# EAGLE design inductor_test_2v0 (EAGLE 6.3)

## Sheet 1 of 5: Inductors
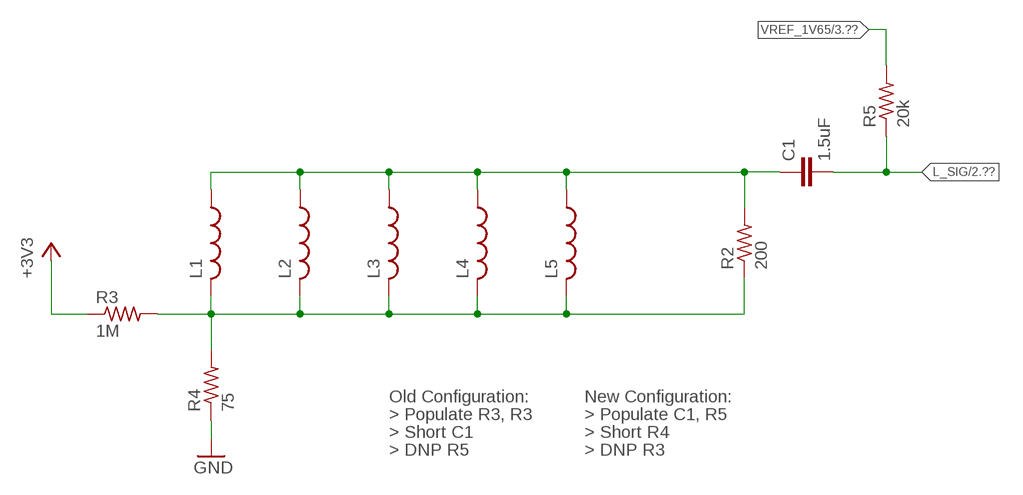
[diagram p0: schematic, sheet 1]

### Parts
C1  1.5uF  C-EUC0402  [C0402]
L1  L-USL0805  [L0805]
L2  L-USL0805  [L0805]
L3  L-USL0805  [L0805]
L4  L-USL0805  [L0805]
L5  L-USL0805  [L0805]
R2  200  R-US_R0402  [R0402]
R3  1M  R-US_R0402  [R0402]
R4  75  R-US_R0402  [R0402]
R5  20k  R-US_R0402  [R0402]

### Nets
+3V3: R3.1 ; also sheet 2,3,4
GND: R4.1 ; also sheet 2,3,4,5
L1P2: L1.2 L2.2 L3.2 L4.2 L5.2 R2.1 R3.2 R4.2
L_SIG: C1.2 R5.1 ; also sheet 2
N$4: C1.1 L1.1 L2.1 L3.1 L4.1 L5.1 R2.2
VREF_1V65: R5.2 ; also sheet 3,5

### Notes on the sheet
- Old Configuration: | New Configuration:
- > Populate R3, R3 | > Populate C1, R5
- > Short C1 | > Short R4
- > DNP R5 | > DNP R3

## Sheet 2 of 5: New Amplifiers
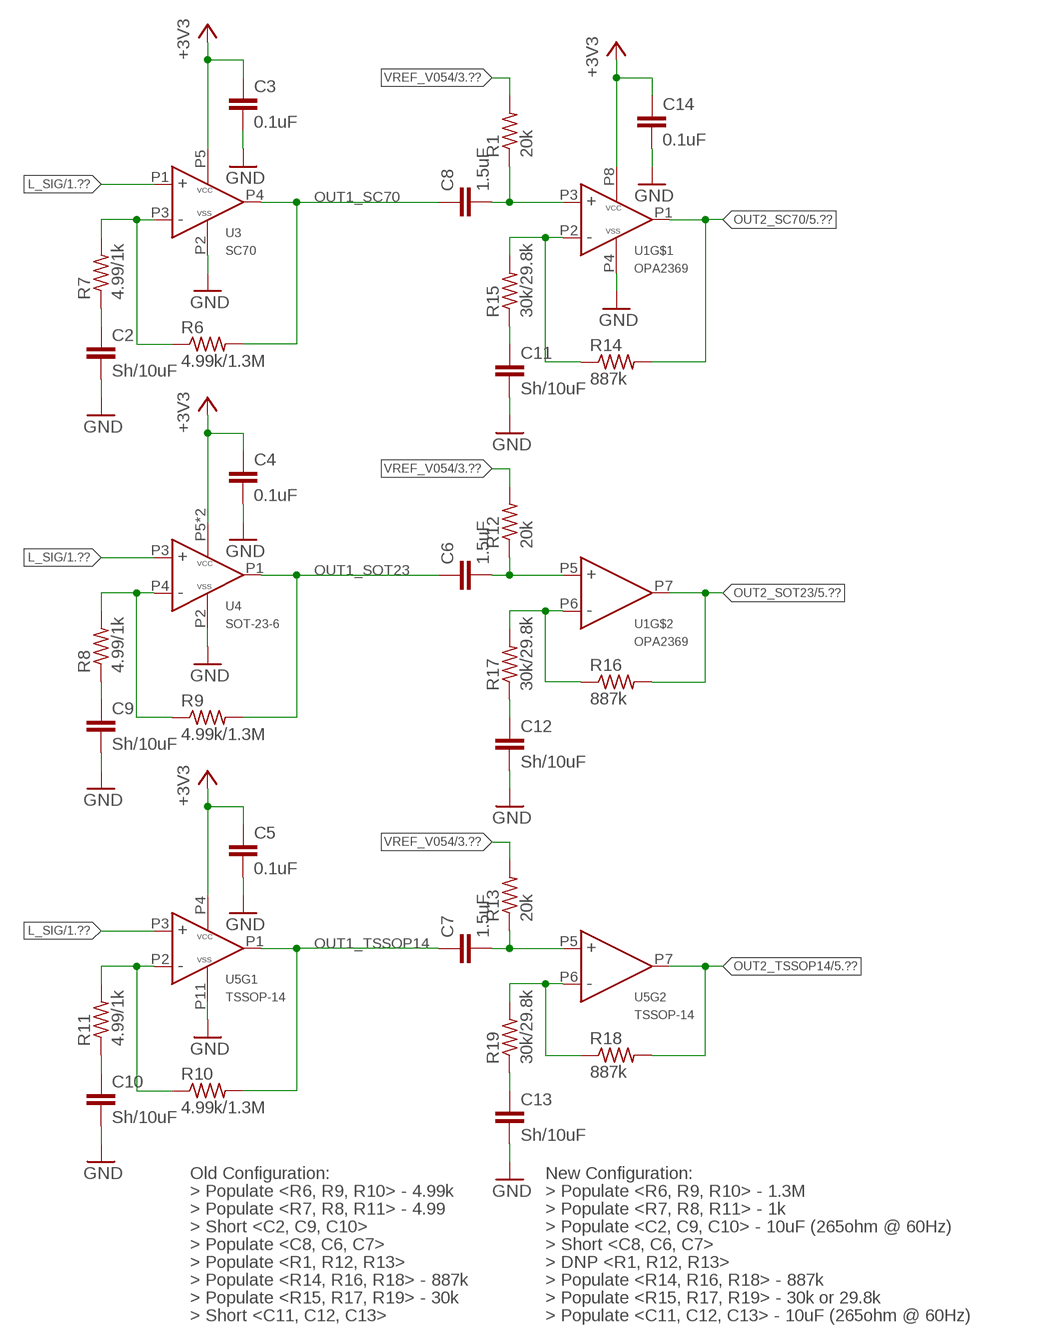
[diagram p1: schematic, sheet 2]

### Parts
C2  Sh/10uF  C-EUC0402  [C0402]
C3  0.1uF  C-EUC0402  [C0402]
C4  0.1uF  C-EUC0402  [C0402]
C5  0.1uF  C-EUC0402  [C0402]
C6  1.5uF  C-EUC0402  [C0402]
C7  1.5uF  C-EUC0402  [C0402]
C8  1.5uF  C-EUC0402  [C0402]
C9  Sh/10uF  C-EUC0402  [C0402]
C10  Sh/10uF  C-EUC0402  [C0402]
C11  Sh/10uF  C-EUC0402  [C0402]
C12  Sh/10uF  C-EUC0402  [C0402]
C13  Sh/10uF  C-EUC0402  [C0402]
C14  0.1uF  C-EUC0402  [C0402]
R1  20k  R-US_R0402  [R0402]
R6  4.99k/1.3M  R-US_R0402  [R0402]
R7  4.99/1k  R-US_R0402  [R0402]
R8  4.99/1k  R-US_R0402  [R0402]
R9  4.99k/1.3M  R-US_R0402  [R0402]
R10  4.99k/1.3M  R-US_R0402  [R0402]
R11  4.99/1k  R-US_R0402  [R0402]
R12  20k  R-US_R0402  [R0402]
R13  20k  R-US_R0402  [R0402]
R14  887k  R-US_R0402  [R0402]
R15  30k/29.8k  R-US_R0402  [R0402]
R16  887k  R-US_R0402  [R0402]
R17  30k/29.8k  R-US_R0402  [R0402]
R18  887k  R-US_R0402  [R0402]
R19  30k/29.8k  R-US_R0402  [R0402]
U1  OPA2369  [SOT-23-8]
U3  SC70  MCP6V3  [SC70-5]
U4  SOT-23-6  MAX4238  [SOT-23-6]
U5  TSSOP-14  LMP2014  [TSSOP-14]

### Nets
+3V3: C3.1 C4.1 C5.1 C14.1 U1.P8(VCC) U3.P5(VCC) U4.P5(VCC) U4.P6(VCC) U5.P4(VCC) ; also sheet 1,3,4
GND: C2.2 C3.2 C4.2 C5.2 C9.2 C10.2 C11.2 C12.2 C13.2 C14.2 U1.P4(VSS) U3.P2(VSS) U4.P2(VSS) U5.P11(VSS) ; also sheet 1,3,4,5
L_SIG: U3.P1(IN+) U4.P3(IN+) U5.P3(IN+) ; also sheet 1
N$1: C10.1 R11.1
N$2: C9.1 R8.1
N$3: R6.1 R7.2 U3.P3(IN-)
N$5: R8.2 R9.1 U4.P4(IN-)
N$6: C2.1 R7.1
N$7: C8.2 R1.1 U1.P3(IN+)
N$8: R10.1 R11.2 U5.P2(IN-)
N$9: R14.1 R15.2 U1.P2(IN-)
N$10: C6.2 R12.1 U1.P5(IN+)
N$11: C11.1 R15.1
N$12: C7.2 R13.1 U5.P5(IN+)
N$14: R16.1 R17.2 U1.P6(IN-)
N$15: C12.1 R17.1
N$17: R18.1 R19.2 U5.P6(IN-)
N$18: C13.1 R19.1
OUT1_SC70: C8.1 R6.2 U3.P4(OUT) ; also sheet 5
OUT1_SOT23: C6.1 R9.2 U4.P1(OUT) ; also sheet 5
OUT1_TSSOP14: C7.1 R10.2 U5.P1(OUT) ; also sheet 5
OUT2_SC70: R14.2 U1.P1(OUT) ; also sheet 5
OUT2_SOT23: R16.2 U1.P7(OUT) ; also sheet 5
OUT2_TSSOP14: R18.2 U5.P7(OUT) ; also sheet 5
VREF_V054: R1.2 R12.2 R13.2 ; also sheet 3,5
Unconnected: U5.P8(OUT) U5.P9(IN-) U5.P10(IN+) U5.P12(IN+) U5.P13(IN-) U5.P14(OUT)

### Notes on the sheet
- Old Configuration: | New Configuration:
- > Populate <R6, R9, R10> - 4.99k | > Populate <R6, R9, R10> - 1.3M
- > Populate <R7, R8, R11> - 4.99 | > Populate <R7, R8, R11> - 1k
- > Short <C2, C9, C10> | > Populate <C2, C9, C10> - 10uF (265ohm @ 60Hz)
- > Populate <C8, C6, C7> | > Short <C8, C6, C7>
- > Populate <R1, R12, R13> | > DNP <R1, R12, R13>
- > Populate <R14, R16, R18> - 887k | > Populate <R14, R16, R18> - 887k
- > Populate <R15, R17, R19> - 30k | > Populate <R15, R17, R19> - 30k or 29.8k
- > Short <C11, C12, C13> | > Populate <C11, C12, C13> - 10uF (265ohm @ 60Hz)

## Sheet 3 of 5: Voltage reference
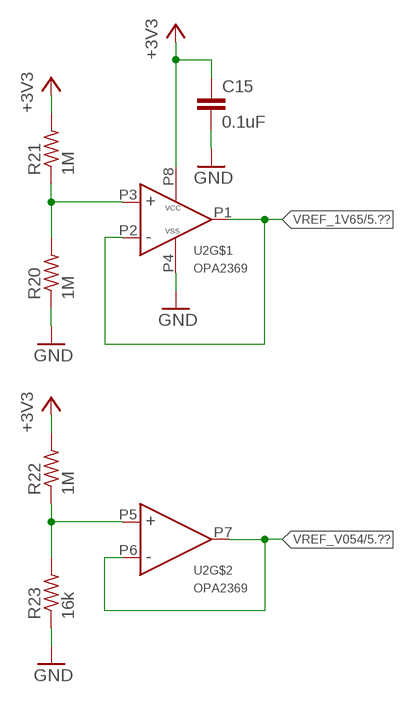
[diagram p2: schematic, sheet 3]

### Parts
C15  0.1uF  C-EUC0402  [C0402]
R20  1M  R-US_R0402  [R0402]
R21  1M  R-US_R0402  [R0402]
R22  1M  R-US_R0402  [R0402]
R23  16k  R-US_R0402  [R0402]
U2  OPA2369  [SOT-23-8]

### Nets
+3V3: C15.1 R21.2 R22.2 U2.P8(VCC) ; also sheet 1,2,4
GND: C15.2 R20.1 R23.1 U2.P4(VSS) ; also sheet 1,2,4,5
N$13: R22.1 R23.2 U2.P5(IN+)
N$16: R20.2 R21.1 U2.P3(IN+)
VREF_1V65: U2.P1(OUT) U2.P2(IN-) ; also sheet 1,5
VREF_V054: U2.P6(IN-) U2.P7(OUT) ; also sheet 2,5

## Sheet 4 of 5: Power Supply
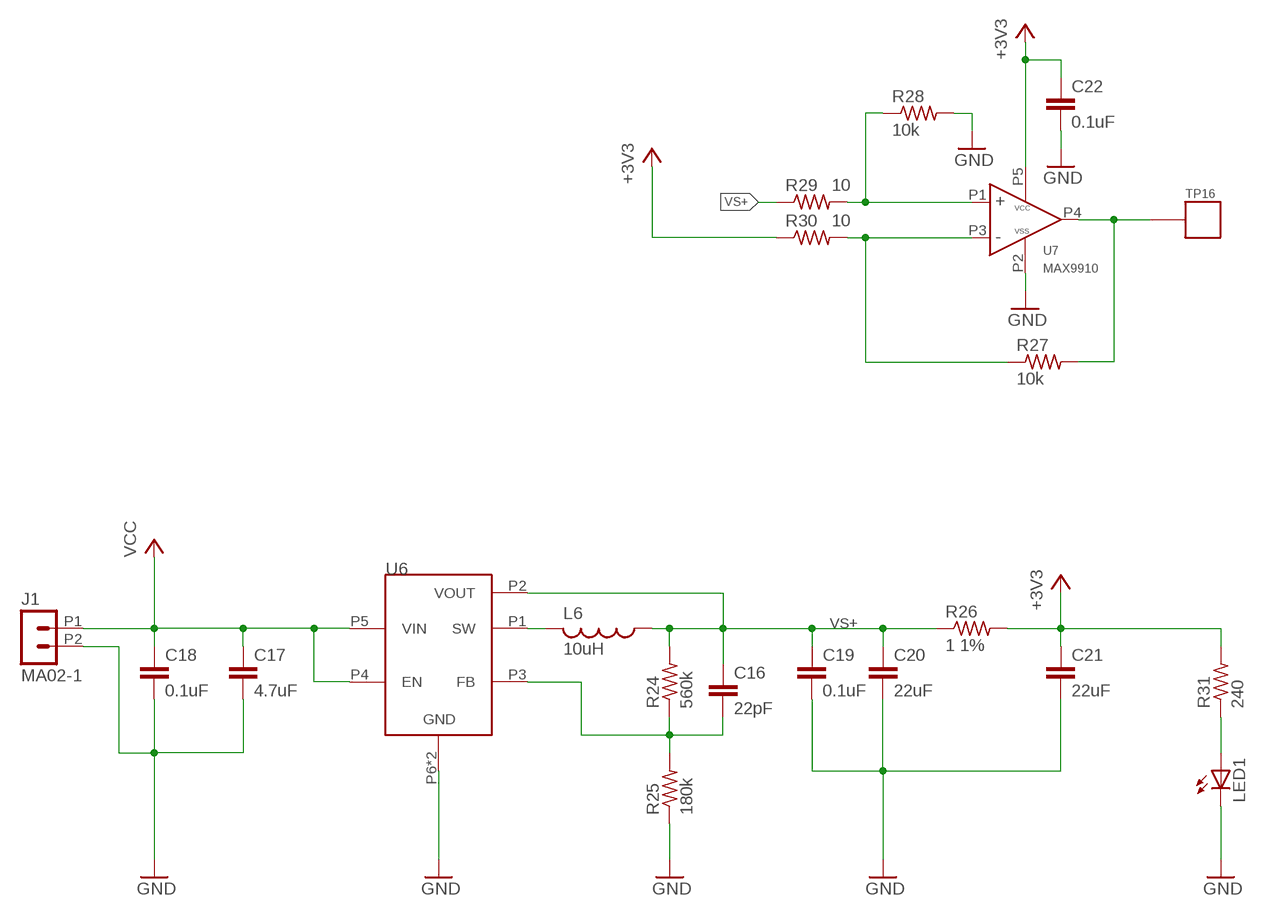
[diagram p3: schematic, sheet 4]

### Parts
C16  22pF  C-EUC0402_SM  [C0402_SM]
C17  4.7uF  C-EUC0402_SM  [C0402_SM]
C18  0.1uF  C-EUC0402_SM  [C0402_SM]
C19  0.1uF  C-EUC0402_SM  [C0402_SM]
C20  22uF  C-EUC0603_SM  [C0603_SM]
C21  22uF  C-EUC0603_SM  [C0603_SM]
C22  0.1uF  C-EUC0603  [C0603]
J1  MA02-1  [MA02-1_MOLEX-TH]
L6  10uH  L-USL0805  [L0805]
LED1  LED3MM  [LED3MM]
R24  560k  R-US_R0402_SM  [R0402_SM]
R25  180k  R-US_R0402_SM  [R0402_SM]
R26  1 1%  R-US_R0603_SM  [R0603_SM]
R27  10k  R-US_R0603  [R0603]
R28  10k  R-US_R0603  [R0603]
R29  10  R-US_R0603  [R0603]
R30  10  R-US_R0603  [R0603]
R31  240  R-US_R0603  [R0603]
TP16  TP_MULT  [TP_MULT]
U6  TPS62122  [WDFN-6]
U7  MAX9910  [SC70-5]

### Nets
+3V3: C21.1 C22.1 R26.2 R30.1 R31.2 U7.P5(VCC) ; also sheet 1,2,3
GND: C17.2 C18.2 C19.2 C20.2 C21.2 C22.2 J1.P2 LED1.K(C) R25.1 R28.2 U6.P6(GND) U6.PAD(GND) U7.P2(VSS) ; also sheet 1,2,3,5
N$19: C16.2 R24.1 R25.2 U6.P3(FB)
N$20: L6.2 U6.P1(SW)
N$21: R28.1 R29.2 U7.P1(IN+)
N$22: R27.1 R30.2 U7.P3(IN-)
N$23: R27.2 TP16.P$1 U7.P4(OUT)
N$24: LED1.A R31.1
VCC: C17.1 C18.1 J1.P1 U6.P4(EN) U6.P5(VIN)
VS+: C16.1 C19.1 C20.1 L6.1 R24.2 R26.1 R29.1 U6.P2(VOUT)

## Sheet 5 of 5: Test Points
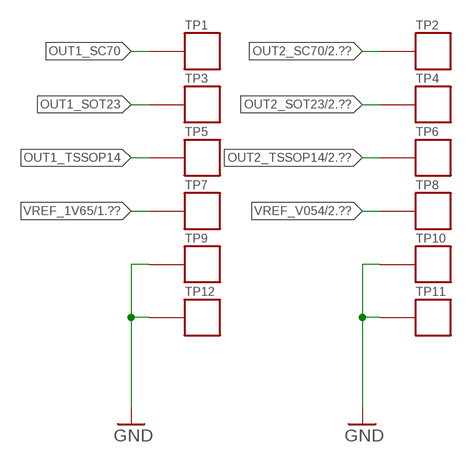
[diagram p4: schematic, sheet 5]

### Parts
TP1  TP_MULT  [TP_MULT]
TP2  TP_MULT  [TP_MULT]
TP3  TP_MULT  [TP_MULT]
TP4  TP_MULT  [TP_MULT]
TP5  TP_MULT  [TP_MULT]
TP6  TP_MULT  [TP_MULT]
TP7  TP_MULT  [TP_MULT]
TP8  TP_MULT  [TP_MULT]
TP9  TP_MULT  [TP_MULT]
TP10  TP_MULT  [TP_MULT]
TP11  TP_MULT  [TP_MULT]
TP12  TP_MULT  [TP_MULT]

### Nets
GND: TP9.P$1 TP10.P$1 TP11.P$1 TP12.P$1 ; also sheet 1,2,3,4
OUT1_SC70: TP1.P$1 ; also sheet 2
OUT1_SOT23: TP3.P$1 ; also sheet 2
OUT1_TSSOP14: TP5.P$1 ; also sheet 2
OUT2_SC70: TP2.P$1 ; also sheet 2
OUT2_SOT23: TP4.P$1 ; also sheet 2
OUT2_TSSOP14: TP6.P$1 ; also sheet 2
VREF_1V65: TP7.P$1 ; also sheet 1,3
VREF_V054: TP8.P$1 ; also sheet 2,3

## Library data of the parts
C1 C6-C8 = rcl:C-EU: CAPACITOR, European symbol; DIGIKEY: 445-13815-1-ND
C2 C9-C13 = rcl:C-EU: CAPACITOR, European symbol; DIGIKEY: 1276-1450-1-ND
C3-C5 C14 C15 C18 C19 C22 = rcl:C-EU: CAPACITOR, European symbol; DIGIKEY: 445-4952-1-ND
C16 = rcl:C-EU: CAPACITOR, European symbol; DIGIKEY: 445-1239-1-ND
C17 = rcl:C-EU: CAPACITOR, European symbol; DIGIKEY: 445-8023-1-ND
C20 C21 = rcl:C-EU: CAPACITOR, European symbol; DIGIKEY: 445-9077-1-ND
J1 = con-lstb:MA02-1; DIGIKEY: WM1870-ND
L1-L5 = rcl:L-US: INDUCTOR, American symbol; DIGIKEY: 732-3452-1-ND
L6 = rcl:L-US: INDUCTOR, American symbol; DIGIKEY: 490-4990-1-ND
LED1 = SparkFun-LED:LED: LEDs Standard schematic elements and footprints for 5mm, 3mm, 1206, and 0603 sized LEDs. 5mm - Spark Fun Electronics SKU : COM-00529 (and others); DIGIKEY: 1125-1181-ND
R1 R5 R12 R13 = rcl:R-US_: RESISTOR, American symbol; DIGIKEY: P20.0KLCT-ND
R2 = rcl:R-US_: RESISTOR, American symbol; DIGIKEY: P200LCT-ND
R3 R20-R22 = rcl:R-US_: RESISTOR, American symbol; DIGIKEY: P1.00MLCT-ND
R4 = rcl:R-US_: RESISTOR, American symbol; DIGIKEY: P75.0LCT-ND
R6 R9 R10 = rcl:R-US_: RESISTOR, American symbol; DIGIKEY: P4.99KLCT-ND; DIGIKEY_2: 541-1.30MLCT-ND
R7 R8 R11 = rcl:R-US_: RESISTOR, American symbol; DIGIKEY: RMCF0402FT4R99CT-ND; DIGIKEY_2: P1.00KLCT-ND
R14 R16 R18 = rcl:R-US_: RESISTOR, American symbol; DIGIKEY: P887KLCT-ND
R15 R17 R19 = rcl:R-US_: RESISTOR, American symbol; DIGIKEY: P30.0KLCT-ND
R23 = rcl:R-US_: RESISTOR, American symbol; DIGIKEY: P16.0KLCT-ND
R24 = rcl:R-US_: RESISTOR, American symbol; DIGIKEY: P560KLCT-ND
R25 = rcl:R-US_: RESISTOR, American symbol; DIGIKEY: P180KLCT-ND
R26 = rcl:R-US_: RESISTOR, American symbol; DIGIKEY: P1.0AJCT-ND
R27 R28 = rcl:R-US_: RESISTOR, American symbol; DIGIKEY: P10KGCT-ND
R29 R30 = rcl:R-US_: RESISTOR, American symbol; DIGIKEY: P10GCT-ND
R31 = rcl:R-US_: RESISTOR, American symbol; DIGIKEY: P240GCT-ND
TP1 TP2 = skyspecs:TP; DIGIKEY: 36-5126-ND
TP3 TP4 = skyspecs:TP; DIGIKEY: 36-5128-ND
TP5 TP6 = skyspecs:TP; DIGIKEY: 36-5014-ND
TP7 TP8 = skyspecs:TP; DIGIKEY: 36-5010-ND
TP9-TP12 = skyspecs:TP; DIGIKEY: 36-5011-ND
TP16 = skyspecs:TP; DIGIKEY: 36-5013-ND
U1 U2 = powerfilm:OPA2369; DIGIKEY: 296-22671-1-ND
U3 = powerfilm:MCP6V3; DIGIKEY: 296-22191-1-ND
U4 = powerfilm:MAX4238; DIGIKEY: MAX4238AUT+TCT-ND
U5 = powerfilm:LMP2014; DIGIKEY: LMP2014MT/NOPB-ND
U6 = powerfilm:TPS62122; DIGIKEY: 296-27695-1-ND
U7 = powerfilm:MAX9910; DIGIKEY: MAX9910EXK+TCT-ND

## Board
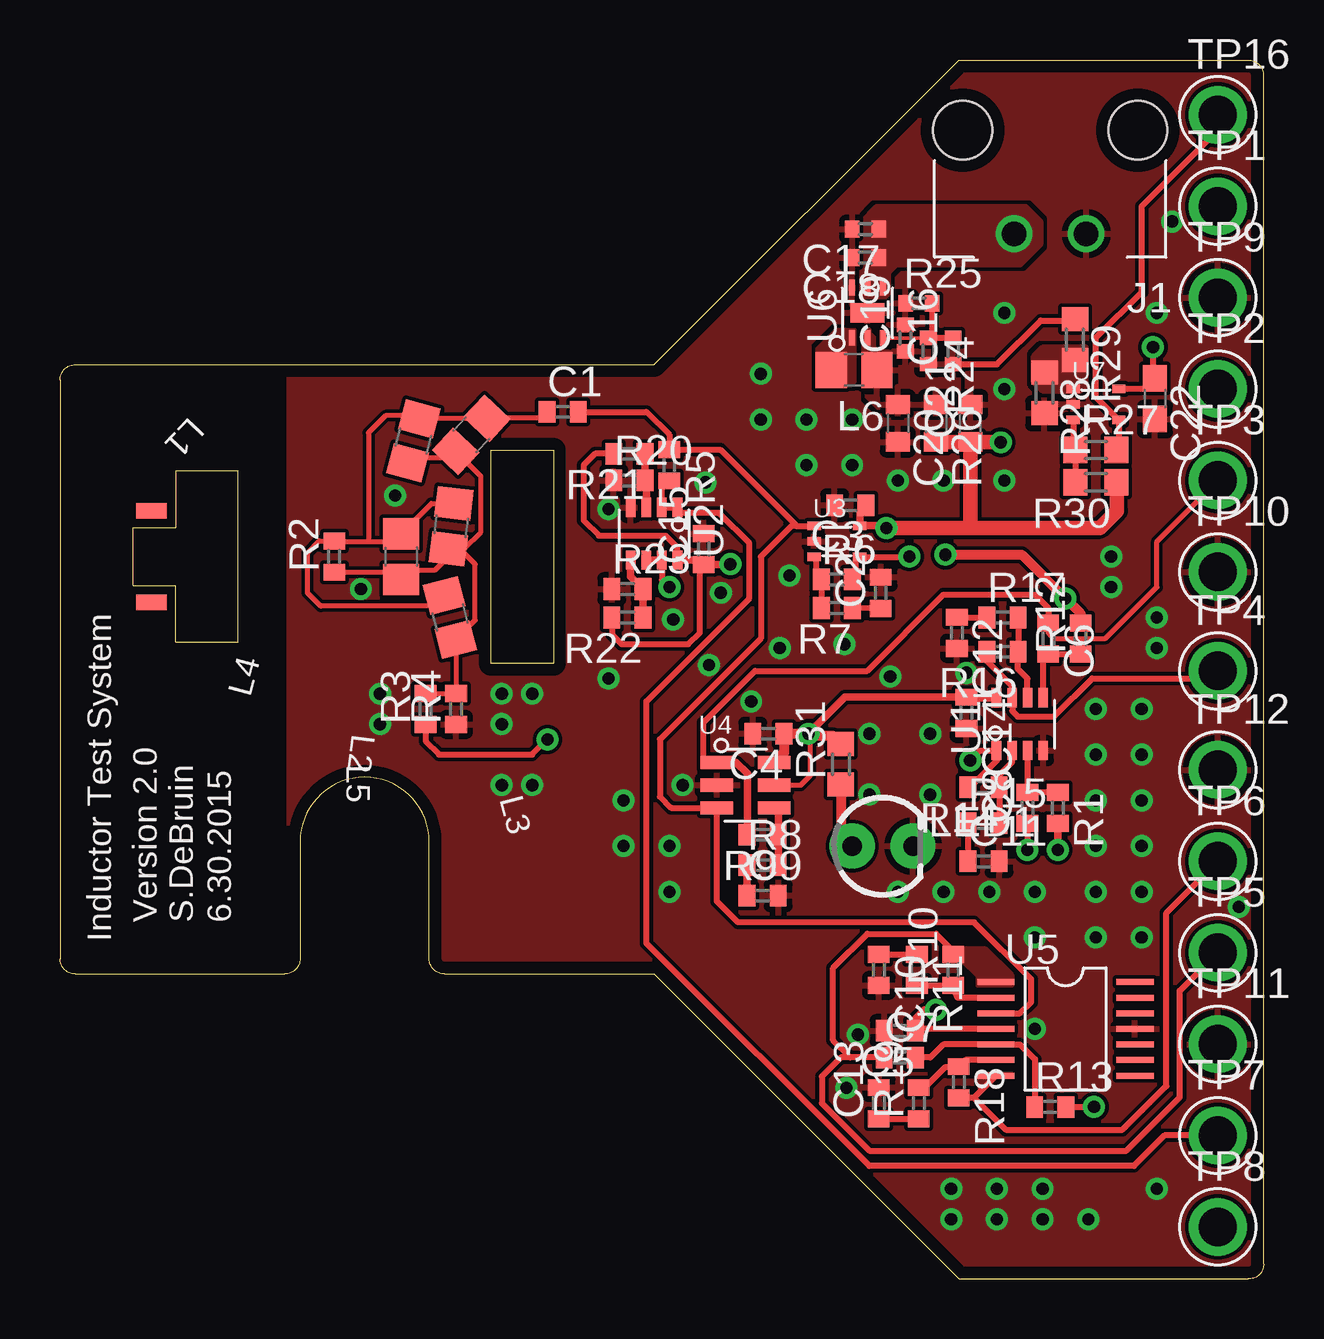
[diagram p5: board, top side]
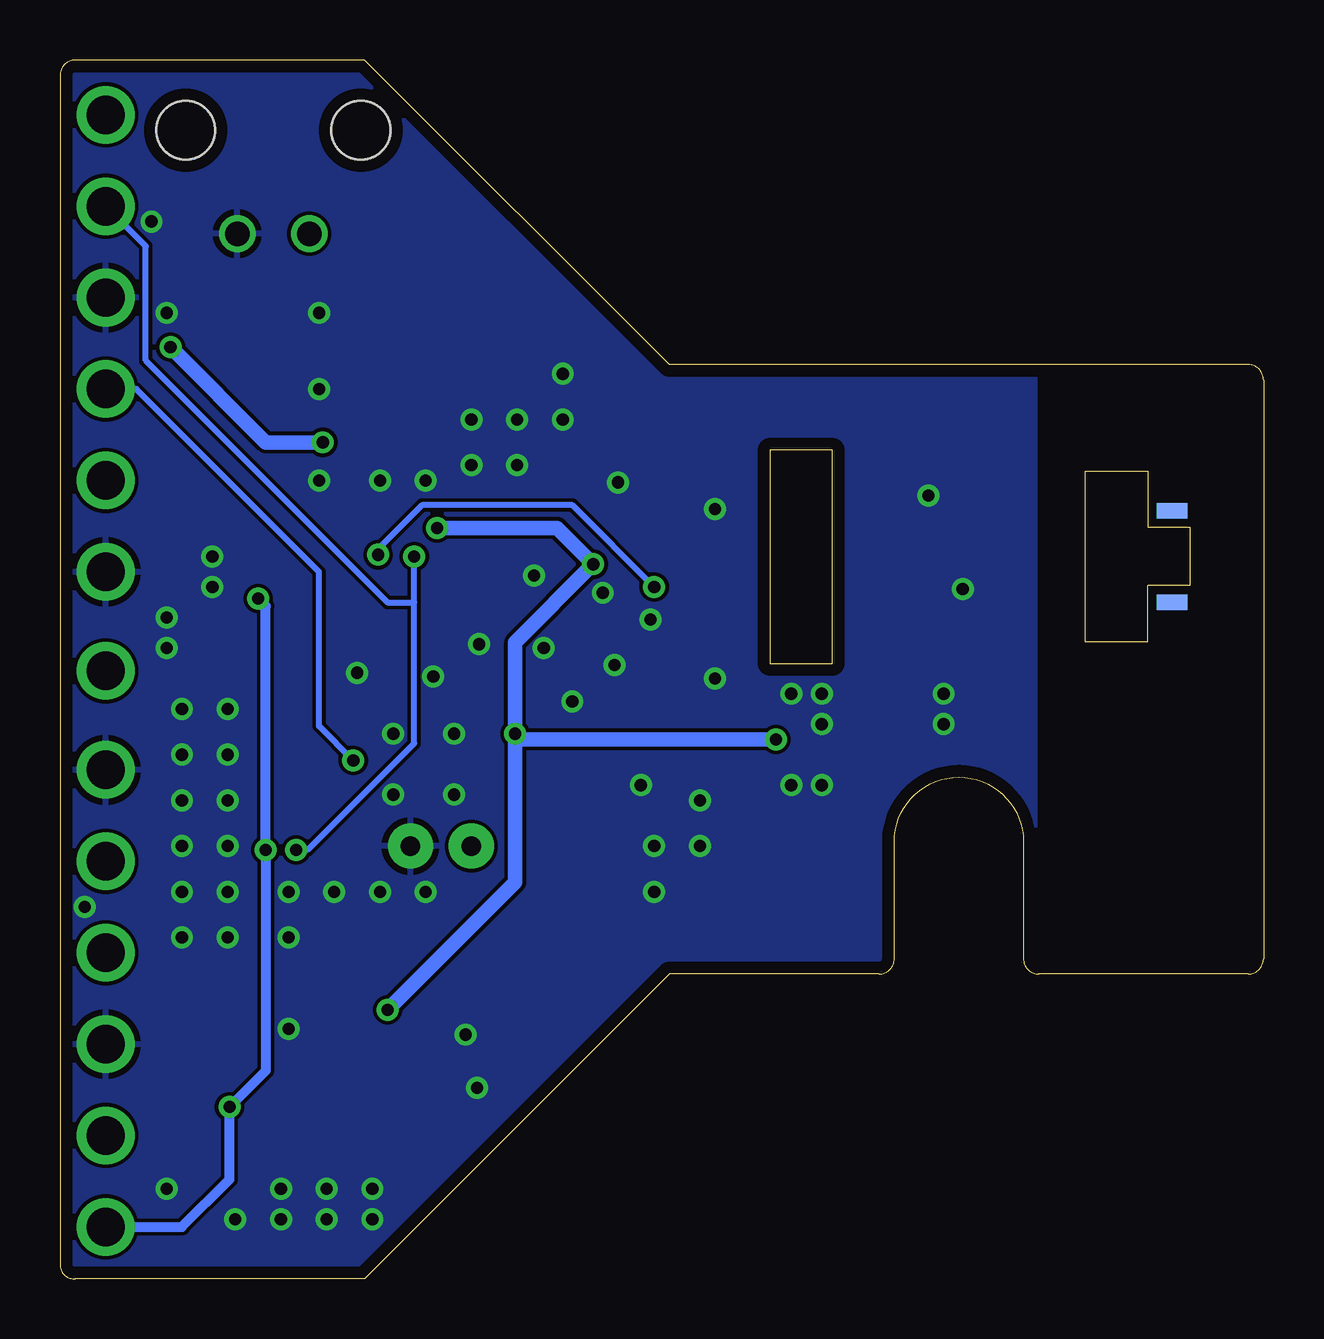
[diagram p6: board, bottom side, seen from below]

Size 50.17 x 50.8 mm. Coordinates in mm from the lower left corner, seen from the top.
Outline: 24.77,38.1 37.47,50.8 49.53,50.8 arc-90 50.17,50.17 50.17,0.64 arc-100 49.53,0 37.47,0 24.77,12.7
Copper layers (1*16): Top 0.0178mm / dielectric 59mil / Bottom 0.0178mm
Design rules "SSC-EAGLE-2Lyr_v1.0.0.3": minimum track width 6mil, minimum drill 14mil, track to track 6mil, track to pad 6mil, pad to pad 6mil, via to via 6mil, smd to smd 6mil, copper to edge 20mil, drill to drill 16mil, minimum pad ring 8mil, minimum via ring 8mil, stop-mask expansion 3mil, vias tented up to drill 0mil, thermal gap 10mil

### Footprints (pad centres in the part's own frame; a part is rotated, then mirrored left to right if it is on the bottom)
C0402 = smd 0.7 x 0.9: 1 -0.65,0; 2 0.65,0
C0402_SM = smd 0.6 x 0.7: 1 -0.55,0; 2 0.55,0
C0603_SM = smd 0.8 x 1: 1 -0.775,0; 2 0.775,0
C0603 = smd 1.1 x 1: 1 -0.85,0; 2 0.85,0
MA02-1_MOLEX-TH = drill 1.02: P1 1.5,4.32; P2 -1.5,4.32 | hole 2.45: 3.65,0; -3.65,0
L0805 = smd 1.3 x 1.5: 1 -0.95,0; 2 0.95,0
LED3MM = drill 0.813 pad 1.88: A -1.27,0; K 1.27,0
R0402 = smd 0.7 x 0.9: 1 -0.65,0; 2 0.65,0
R0402_SM = smd 0.6 x 0.7: 1 -0.55,0; 2 0.55,0
R0603_SM = smd 0.8 x 1: 1 -0.775,0; 2 0.775,0
R0603 = smd 1 x 1.1: 1 -0.85,0; 2 0.85,0
TP_MULT = drill 1.6: P$1 0,0
SOT-23-8 = smd 0.8 x 0.4: P1 -1.1,0.975; P2 -1.1,0.325; P3 -1.1,-0.325; P4 -1.1,-0.975; P5 1.1,-0.975; P6 1.1,-0.325; P7 1.1,0.325; P8 1.1,0.975
SC70-5 = smd 0.55 x 0.35: P1 -0.95,0.65; P2 -0.95,0; P3 -0.95,-0.65; P4 0.95,-0.65; P5 0.95,0.65
SOT-23-6 = smd 1.35 x 0.55: P1 -1.2,0.95; P2 -1.2,0; P3 -1.2,-0.95; P4 1.2,-0.95; P5 1.2,0; P6 1.2,0.95
TSSOP-14 = smd 1.55 x 0.25: P1 -2.9,1.95; P2 -2.9,1.3; P3 -2.9,0.65; P4 -2.9,0; P5 -2.9,-0.65; P6 -2.9,-1.3; P7 -2.9,-1.95; P8 2.9,-1.95; P9 2.9,-1.3; P10 2.9,-0.65; P11 2.9,0; P12 2.9,0.65; P13 2.9,1.3; P14 2.9,1.95
WDFN-6 = smd 0.65 x 0.25: P1 -1.05,0.65; P2 -1.05,0; P3 -1.05,-0.65; P4 1.05,-0.65; P5 1.05,0; P6 1.05,0.65 | smd 0.8 x 1.4: PAD 0,0
NEMA_F2 = smd 1.27 x 0.635: P1 -8.89,1.905; P2 -8.89,-1.905 | smd 1.27 x 0.635 bottom: P3 -8.89,-1.905; P4 -8.89,1.905

### Placement (x,y rotation side)
C1  [C0402]  20.95,36.13 0 top
C2  [C0402]  34.21,28.59 90 top
C3  [C0402]  32.94,32.24 180 top
C4  [C0402]  29.53,22.72 180 top
C5  [C0402]  35,10.34 180 top
C6  [C0402]  41.2,26.69 270 top
C7  [C0402]  35,9.23 0 top
C8  [C0402]  40.32,19.62 90 top
C9  [C0402]  29.29,15.97 0 top
C10  [C0402]  34.13,12.88 270 top
C11  [C0402]  38.5,17.4 0 top
C12  [C0402]  37.39,26.93 270 top
C13  [C0402]  34.13,7.32 90 top
C14  [C0402]  37.78,23.59 270 top
C15  [C0402]  26.83,30.42 90 top
C16  37.23,38.67 90 top
C17  33.58,43.75 180 top
C18  33.58,42.56 180 top
C19  35.24,39.21 90 top
C20  34.92,35.66 270 top
C21  37.94,35.66 90 top
C22  45.64,36.69 270 top
J1  41.27,47.88 180 top
L1  17.14,35.18 226.6 top
L2  16.31,31.37 262.9 top
L3  16.26,27.56 284.7 top
L4  14.73,34.93 255.1 top
L5  14.22,30.1 270 top
L6  33.1,37.88 180 top
LED1  34.29,18.04 0 top
R1  [R0402]  41.59,19.62 270 top
R2  11.43,30.1 90 top
R3  15.24,23.75 90 top
R4  16.51,23.75 90 top
R5  [R0402]  25.4,33.91 270 top
R6  [R0402]  32.38,29.15 0 top
R7  [R0402]  32.38,27.96 180 top
R8  [R0402]  29.29,17.24 0 top
R9  [R0402]  29.29,18.51 180 top
R10  [R0402]  37.23,12.88 90 top
R11  [R0402]  35.72,12.88 270 top
R12  [R0402]  42.55,26.69 90 top
R13  [R0402]  41.27,7.16 0 top
R14  [R0402]  38.5,20.5 180 top
R15  [R0402]  38.5,18.99 0 top
R16  [R0402]  39.29,26.13 180 top
R17  [R0402]  39.29,27.56 0 top
R18  [R0402]  37.47,8.19 270 top
R19  [R0402]  35.8,7.32 90 top
R20  [R0402]  23.73,33.28 0 top
R21  [R0402]  23.73,34.39 180 top
R22  [R0402]  23.65,27.56 180 top
R23  [R0402]  23.65,28.75 0 top
R24  36.2,38.67 270 top
R25  35.8,40.66 0 top
R26  36.51,35.66 270 top
R27  43.18,34.55 0 top
R28  41.04,36.93 270 top
R29  42.31,39.15 270 top
R30  43.18,33.2 180 top
R31  [R0603]  32.54,21.45 90 top
TP1  48.26,44.71 0 top
TP2  48.26,37.09 0 top
TP3  48.26,33.28 0 top
TP4  48.26,25.34 0 top
TP5  48.26,13.59 0 top
TP6  48.26,17.4 0 top
TP7  48.26,5.97 0 top
TP8  48.26,2.16 0 top
TP9  48.26,40.9 0 top
TP10  48.26,29.47 0 top
TP11  48.26,9.78 0 top
TP12  48.26,21.21 0 top
TP16  48.26,48.52 0 top
U1  40,23.12 90 top
U2  24.77,31.05 270 top
U3  32.38,30.74 0 top
U4  28.57,20.58 0 top
U5  41.91,10.42 0 top
U6  33.66,40.26 90 top
U7  43.18,36.45 0 top
U$2  [NEMA_F2]  12.7,30.1 0 top

### Tracks (layer width: path | path; a pad name or v marks a point on that pad's centre or on a via)
+3V3  (via drill 0.51)
  Top 0.203: U4.P5 30.88,20.58 31.27,20.97 31.27,22.64 v31.19,22.72
  Top 0.254: U5.P4 35.81,10.42 C5.1 | U7.P5 45.2,37.1 C22.1 45.56,37.62 v45.56,38.83 | R22.2 23,26.86 23.42,26.45 26.19,26.45 26.67,26.93 26.67,29.61 C15.1 | R3.1 15.24,22.4 15.8,21.85 19.68,21.85 v20.32,22.48 | R21.2 22.3,34.39 21.83,33.91 21.83,31.61 22.46,30.97 25.24,30.97 25.72,30.5 25.72,30.27 26.04,29.95
  Top 0.305: v36.51,11.21 36.04,11.21 35.64,10.81 35.64,10.35 C5.1 | U1.P8 37.81,24.22 C14.1 32.72,24.24 v31.19,22.72 | C3.1 33.34,31.99 U3.P5 34.35,31.39 v34.45,31.29 | U2.P8 26.04,29.95 26.64,29.95 C15.1 27.92,29.77 v27.94,29.78 | 39.19,34.88 v39.21,34.86
  Top 0.406: U4.P6 30.18,21.93 C4.1 v31.19,22.72 | 44.05,33.17 R30.1 | 37.94,31.45 38.1,31.29 | 31.27,22.64 32.2,22.64 R31.2
  Top 0.61: v34.45,31.29 38.1,31.29 43.34,31.29 44.05,32.01 44.05,33.17 | C21.1 37.94,31.45 | R26.2 C21.1 | C21.1 39.19,34.88
  Bottom 0.406: v31.19,22.72 31.19,22.48
  Bottom 0.61: v36.51,11.21 31.19,16.53 31.19,22.48 v20.32,22.48 | v34.45,31.29 29.45,31.29 v27.94,29.78 31.19,26.53 v31.19,22.72 | v39.21,34.86 41.59,34.86 v45.56,38.83
GND  (via drill 0.51)
  other vias: 33.26,10.18 32.78,7.96 49.13,15.5 45.72,3.75 42.86,2.48 39.05,2.48 37.15,3.75 39.05,3.75 40.96,3.75 40.96,2.48 37.15,2.48 12.54,28.75 13.97,32.64 28.81,24.07 37.78,25.26 36.27,22.72 36.27,20.18 33.73,20.18 33.73,22.72 25.96,20.58 25.4,16.13 23.49,19.94 23.49,18.04 25.4,18.04 46.36,44.07 45.72,40.26 39.37,37.09 39.37,40.26 34.92,33.28 36.83,33.28 39.37,33.28 22.86,25.02 26.91,33.2 25.56,27.48 22.86,32.09 27.05,25.58 27.54,28.59 43.81,30.1 43.81,28.83 45.72,27.56 45.72,26.29 43.18,23.75 45.08,23.75 45.08,21.85 45.08,19.94 45.08,18.04 45.08,16.13 45.08,14.23 43.18,14.23 43.18,16.13 43.18,18.04 43.18,19.94 43.18,21.85 40.64,16.13 40.64,14.23 38.73,16.13 36.83,16.13 34.92,16.13 33.02,33.91 31.11,33.91 31.11,35.82 33.02,35.82 29.21,35.82 29.21,37.72 18.41,24.39 19.68,24.39 18.41,23.12 18.41,20.58 19.68,20.58 13.33,24.39 13.33,23.12 34.61,25.1 32.7,26.45 30.4,29.31 30,26.29 40.64,10.42
  pour Top (rank 6): 50.17,0 50.17,50.8 37.47,50.8 24.77,38.1 9.52,38.1 9.52,12.7 24.77,12.7 37.47,0
  pour Bottom (rank 6): 50.17,0 50.17,50.8 37.47,50.8 24.77,38.1 9.52,38.1 9.52,12.7 24.77,12.7 37.47,0
L1P2
  Top 0.203: R2.1 11.45,29.47 13.81,29.47 14.13,29.15 L5.2 14.62,29.55 15.64,29.55 16.19,30.1 L2.2 | L2.2 16.66,30.43 17.3,29.78 17.3,27.45 L3.2 16.51,26.63 R4.2 R3.2 | L4.2 14.71,34.23 16.19,34.23 16.45,34.49 L1.2 17.54,33.44 17.54,31.13 16.84,30.43 L2.2
L_SIG
  Top 0.254: U5.P3 40.02,11.07 40.48,11.53 40.48,12.48 38.1,14.86 28.26,14.86 27.38,15.73 27.38,19.62 U4.P3 25.48,19.63 25,20.1 25,22.48 29.21,26.69 29.21,30.1 30.48,31.37 30.72,31.37 | C1.2 24.45,36.13 25.4,35.18 R5.1 27.53,34.56 30.72,31.37 | 30.72,31.37 31.42,31.37 U3.P1
N$1
  Top 0.254: C10.1 R11.1
N$2
  Top 0.305: R8.1 C9.1
N$3
  Top 0.254: U3.P3 31.51,30.01 31.51,29.47 31.73,29.24 R6.1 R7.2
N$4
  Top 0.203: L2.1 15.49,32.31 L5.1 13.97,31.05 13.65,30.74 12.86,30.74 | 12.86,30.74 11.45,30.74 R2.2 10.81,30.75 10.32,30.26 10.32,28.59 10.87,28.04 15.57,28.04 L3.1 | C1.1 20.04,35.87 L1.1 17.77,35.85 L4.1 14.85,35.98 13.57,35.98 12.86,35.26 12.86,30.74
N$5
  Top 0.305: U4.P4 29.94,19.46 R9.1 R8.2
N$6
  Top 0.254: C2.1 R7.1
N$7
  Top 0.254: U1.P3 C8.2 R1.1
N$8
  Top 0.254: U5.P2 37.42,11.72 R10.1 R11.2
N$9
  Top 0.254: U1.P2 39.68,21.52 39.13,20.97 39.13,20.51 R14.1 R15.2
N$10
  Top 0.254: U1.P5 40.98,25.82 C6.2 R12.1
N$11
  Top 0.254: R15.1 C11.1
N$12
  Top 0.254: R13.1 40.64,7.18 40.64,9.15 40.02,9.77 U5.P5 36.81,9.77 36.27,9.23 C7.2
N$13
  Top 0.305: U2.P5 23.79,29.27 R23.2 R22.1
N$14
  Top 0.254: U1.P6 40.33,25.01 39.93,25.42 39.93,26.12 R16.1 R17.2
N$15
  Top 0.254: C12.1 37.4,27.56 R17.1
N$16
  Top 0.305: U2.P3 24.44,33.22 R20.2 R21.1
N$17
  Top 0.254: U5.P6 37.74,9.12 R18.1 37.45,8.83 36.91,8.83 36.05,7.97 R19.2
N$18
  Top 0.254: C13.1 R19.1
N$19
  Top 0.152: U6.P3 36.18,39.21
  Top 0.203: 36.18,39.21 R24.1
  Top 0.254: R25.2 36.35,39.38 R24.1 C16.2
N$20
  pour Top (rank 2, no thermals): 33.1,39.55 33.1,37.4 32.94,37.25 31.59,37.25 31.59,38.75 32.38,39.55
N$21
  pour Top (no thermals): 42.39,37.01 42.55,37.01 42.78,37.25 42.78,38.83 40.96,38.83 40.56,38.44 40.56,37.4 40.96,37.01
N$22
  Top 0.254: R30.2 R27.1 42.23,34.65 U7.P3
N$23
  Top 0.254: R27.2 44.13,34.65 U7.P4 43.18,36.75 43.18,39.23 45.08,41.13 45.08,44.71 48.26,47.88 TP16.P$1
N$24
  Top 0.406: R31.1 32.54,18.51 LED1.A
OUT1_SC70  (via drill 0.51)
  Top 0.254: R6.2 33.18,29.29 33.18,29.93 U3.P4 35.39,30.09 v35.4,30.1 | C8.1 v40.32,17.88
  Bottom 0.254: v40.32,17.88 39.85,17.88 35.4,22.32 35.4,28.2 | 35.4,28.2 v35.4,30.1 | TP1.P$1 46.59,43.04 46.59,38.28 36.51,28.2 35.4,28.2
OUT1_SOT23
  Top 0.203: 41.2,27.96 41.2,26.93 41.43,26.69 43.58,26.69 45.72,28.83 45.72,30.74 TP3.P$1
  Top 0.254: U4.P1 26.91,21.53 26.83,21.61 26.83,23.2 28.97,25.34 33.66,25.34 36.83,28.51 40.64,28.51 41.2,27.96 C6.1
  Top 0.305: U4.P1 28.18,21.53 28.65,21.05 28.65,18.53 R9.2
OUT1_TSSOP14
  Top 0.254: C7.1 32.94,9.23 | 32.94,9.23 32.23,9.94 32.23,12.96 33.66,14.39 36.51,14.39 37.23,13.67 R10.2 | 32.94,9.23 32.54,9.23 31.75,8.43 31.75,7.32 33.73,5.34 44.45,5.34 46.67,7.56 46.67,12 TP5.P$1
  pour Top (no thermals): 38.26,12.24 39.69,12.24 39.69,12.64 38.58,13.75 36.91,13.75 36.91,13.27 37.62,13.27 38.26,12.64
OUT2_SC70  (via drill 0.51)
  Top 0.254: R14.2 37.94,20.5 39.05,21.61 39.05,21.99 U1.P1 38.35,22.02 v37.94,21.61
  Bottom 0.254: v37.94,21.61 39.37,23.04 39.37,29.47 46.99,37.09 TP2.P$1
OUT2_SOT23
  Top 0.254: R16.2 38.64,25.75 39.68,24.71 U1.P7 39.69,24.21 39.69,23.67 39.93,23.43 41.43,23.43 43.02,25.02 47.62,25.02 47.94,25.34 TP4.P$1
OUT2_TSSOP14
  Top 0.254: U5.P7 38.09,7.54 | 38.09,7.54 R18.2 | 38.09,7.54 39.42,6.21 44.29,6.21 46.12,8.04 46.12,15.26 TP6.P$1
  pour Top (no thermals): 39.69,8.51 38.34,8.51 38.34,7.88 38.89,8.43 39.69,8.43
VCC
  pour Top (no thermals): 39.85,44.71 40.24,44.71 40.88,44.07 40.88,43.12 40,42.25 34.85,42.25 34.53,41.93 34.53,41.06 34.37,40.9 33.58,40.9 33.42,41.06 33.42,41.93 33.42,44.07 34.05,44.71
VREF_1V65
  Top 0.254: TP7.P$1 46.04,5.97 44.77,4.7 33.73,4.7 24.45,13.99 24.45,24.07 28.73,28.36 28.73,30.66 27.46,31.93 25.74,31.93 U2.P1 U2.P2 25.09,32.95 R5.2
VREF_V054  (via drill 0.51)
  Top 0.254: R13.2 v43.1,7.16 | U2.P7 25.09,29.14 v25.4,28.83
  Top 0.305: R1.2 v41.59,17.88 | U2.P6 U2.P7
  Top 0.406: R12.2 42.55,27.72 v41.91,28.36 40.08,30.18 v36.91,30.18
  Bottom 0.254: v25.4,28.83 28.81,32.24 35.08,32.24 36.91,30.42 v36.91,30.18
  Bottom 0.406: TP8.P$1 45.08,2.16 43.1,4.15 v43.1,7.16 41.59,8.67 v41.59,17.88 41.59,28.04 v41.91,28.36
VS+
  Top 0.254: C16.1 39.06,38.12 40.88,39.94 42.25,39.94 R29.1
  pour Top (no thermals): 33.73,39.55 33.5,39.55 33.5,37.25 34.61,37.25 34.61,38.52 33.73,39.39
  pour Top: 34.37,36.05 36.91,36.05 37.47,36.61 37.47,38.36 36.91,38.91 35,38.91 34.69,38.59 34.37,38.59 33.5,37.72 33.5,36.93

### Text on the board
tPlace: Version 2.0 | S.DeBruin | 6.30.2015 | Inductor Test System